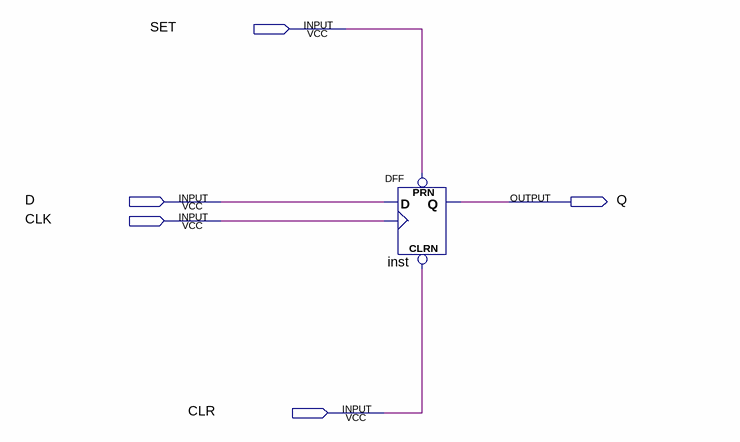
[diagram p0: schematic sheet]
// Quartus schematic ea01m02e01.bdf as structural Verilog: 1 symbols, 5 pins
module ea01m02e01 (
  input  SET,
  input  D,
  input  CLK,
  input  CLR,
  output Q
);

  DFF inst (.CLRN(CLR), .CLK(CLK), .D(D), .PRN(SET), .Q(Q));
endmodule
